# EAGLE design main (EAGLE 6.6.0)
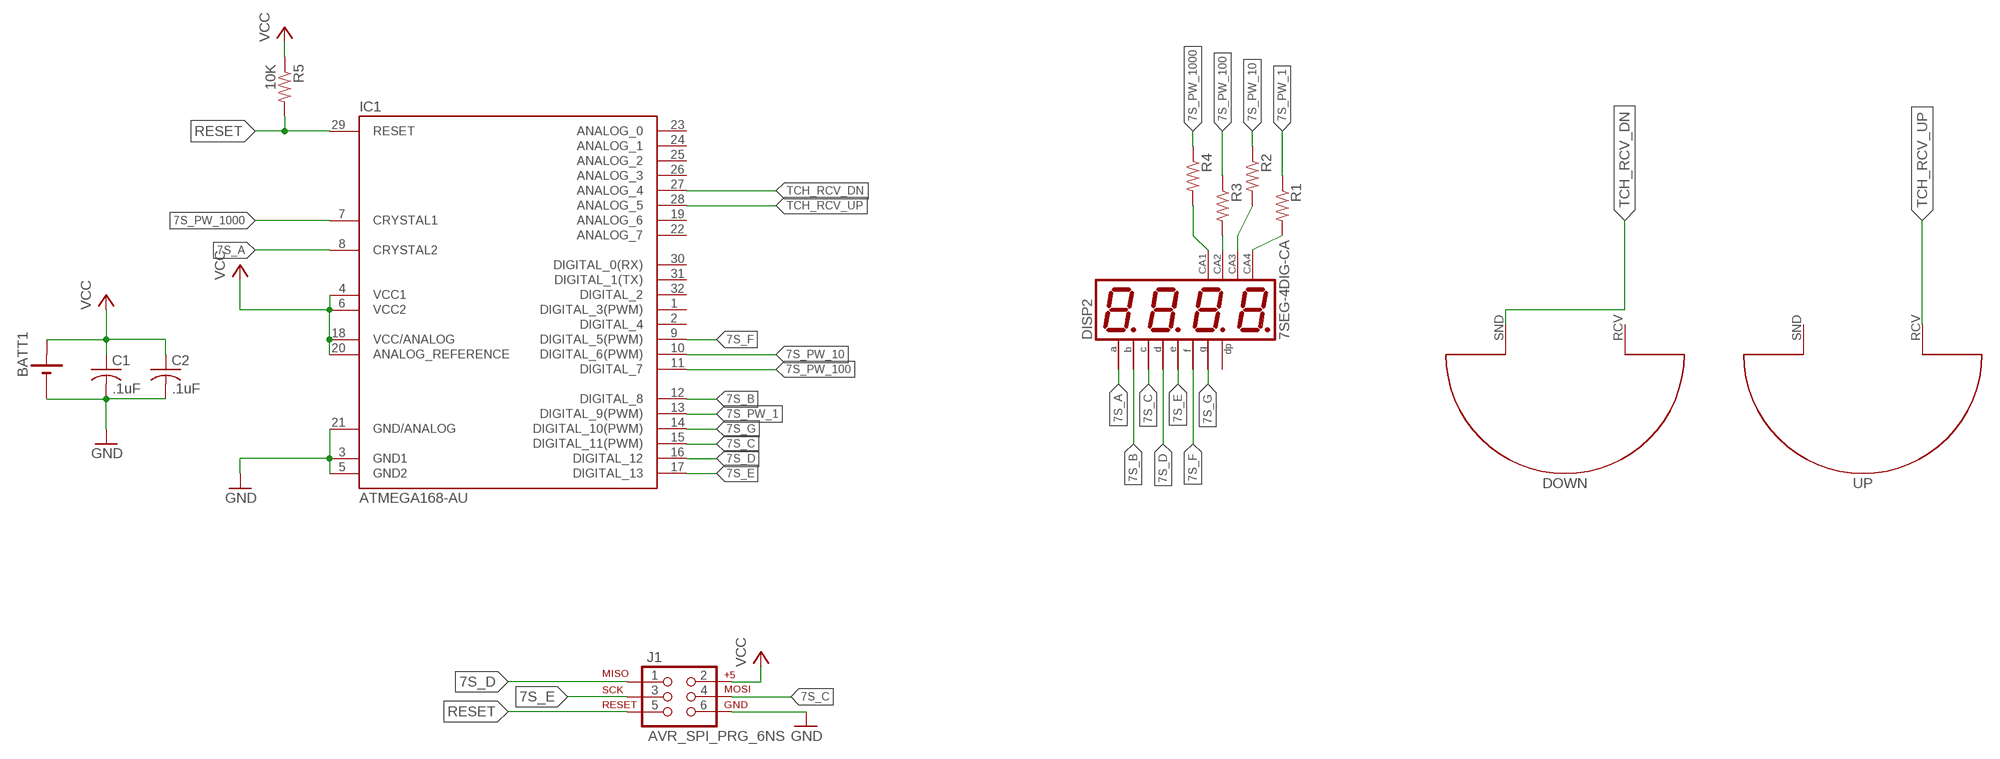
[diagram p0: schematic, sheet 1]

## Parts
BATT1  2032SMD  [2032SMD]
C1  .1uF  C-USC0603  [C0603]
C2  .1uF  C-USC0603  [C0603]
DISP2  7SEG-4DIG-CA  [7SEG-0.36-4]
DOWN  AVD-TCH-01  [AVD-TCH-01]
IC1  ATMEGA168-AU  [TQFP32-08]
J1  AVR_SPI_PRG_6NS  [2X3-NS]
R1  R-US_R0603  [R0603]
R2  R-US_R0603  [R0603]
R3  R-US_R0603  [R0603]
R4  R-US_R0603  [R0603]
R5  10K  R-US_R0603  [R0603]
UP  AVD-TCH-01  [AVD-TCH-01]

## Nets
7S_A: DISP2.11(A) IC1.8(CRYSTAL2)
7S_B: DISP2.7(B) IC1.12(DIGITAL_8)
7S_C: DISP2.4(C) IC1.15(DIGITAL_11(PWM)) J1.4
7S_D: DISP2.2(D) IC1.16(DIGITAL_12) J1.1
7S_E: DISP2.1(E) IC1.17(DIGITAL_13) J1.3
7S_F: DISP2.10(F) IC1.9(DIGITAL_5(PWM))
7S_G: DISP2.5(G) IC1.14(DIGITAL_10(PWM))
7S_PW_1: IC1.13(DIGITAL_9(PWM)) R1.1
7S_PW_10: IC1.10(DIGITAL_6(PWM)) R2.1
7S_PW_100: IC1.11(DIGITAL_7) R3.1
7S_PW_1000: IC1.7(CRYSTAL1) R4.1
GND: BATT1.- C1.2 C2.2 IC1.3(GND1) IC1.5(GND2) IC1.21(GND/ANALOG) J1.6
N$2: DISP2.6(CA4) R1.2
N$3: DISP2.8(CA3) R2.2
N$4: DISP2.9(CA2) R3.2
N$5: DISP2.12(CA1) R4.2
RESET: IC1.29(RESET) J1.5 R5.2
TCH_RCV_DN: DOWN.SND IC1.27(ANALOG_4)
TCH_RCV_UP: IC1.28(ANALOG_5) UP.RCV
VCC: BATT1.+ C1.1 C2.1 IC1.4(VCC1) IC1.6(VCC2) IC1.18(VCC/ANALOG) IC1.20(ANALOG_REFERENCE) J1.2 R5.1
Unconnected: DISP2.3(DP) DOWN.RCV IC1.1(DIGITAL_3(PWM)) IC1.2(DIGITAL_4) IC1.19(ANALOG_6) IC1.22(ANALOG_7) IC1.23(ANALOG_0) IC1.24(ANALOG_1) IC1.25(ANALOG_2) IC1.26(ANALOG_3) IC1.30(DIGITAL_0(RX)) IC1.31(DIGITAL_1(TX)) IC1.32(DIGITAL_2) UP.SND

## Library data of the parts
BATT1 = rbg-4ucon-battery:2032SMD
C1 C2 = rcl:C-US: CAPACITOR, American symbol
DISP2 = led-display-4digit:7SEG-4DIG-CA
DOWN UP = touch-me:AVD-TCH-01: AVD Touch Me Sensor, half circle, active cap.
IC1 = Arduino-AVR:ATMEGA168
J1 = SparkFun-Connectors:AVR_SPI_PRG_6: AVR ISP 6 Pin This is the reduced ISP connector for AVR programming. Common on Arduino. This footprint will take up less PCB space and can be used with a 10-pin to 6-pin adapter such as SKU: BOB-08508 **Special note about "TEST_POINT" package. The stop mask is on the top side, so if you want your programming test points to be on the bottom of your board, make sure to place this package on the bottom side of the board. This also ensure that the orientation to program from the bottom side will be correct.
R1-R5 = rcl:R-US_: RESISTOR, American symbol

## Board
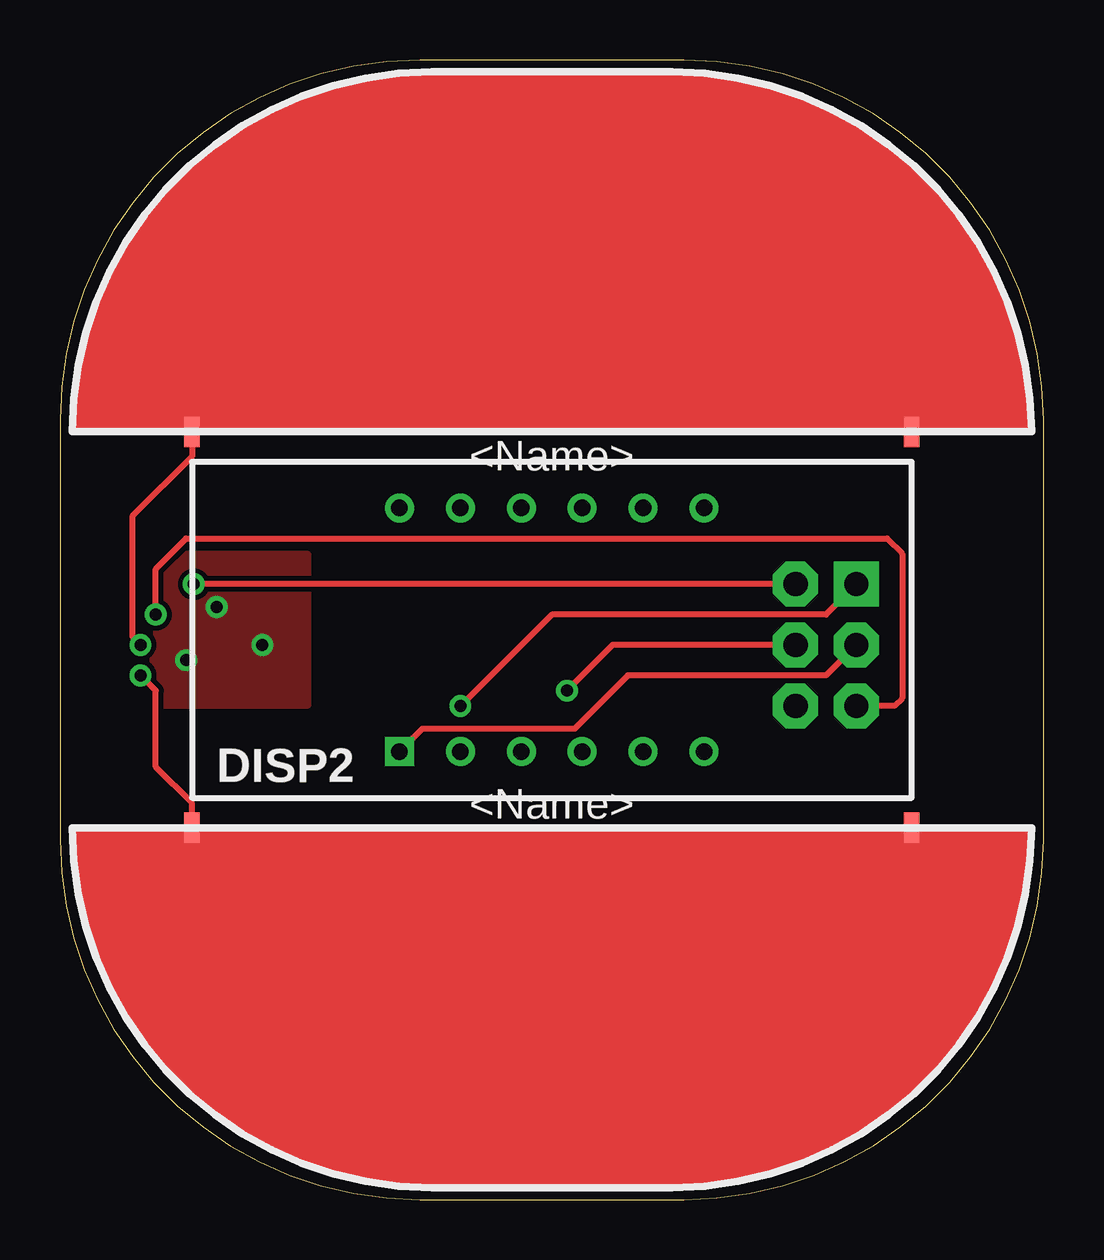
[diagram p1: board, top side]
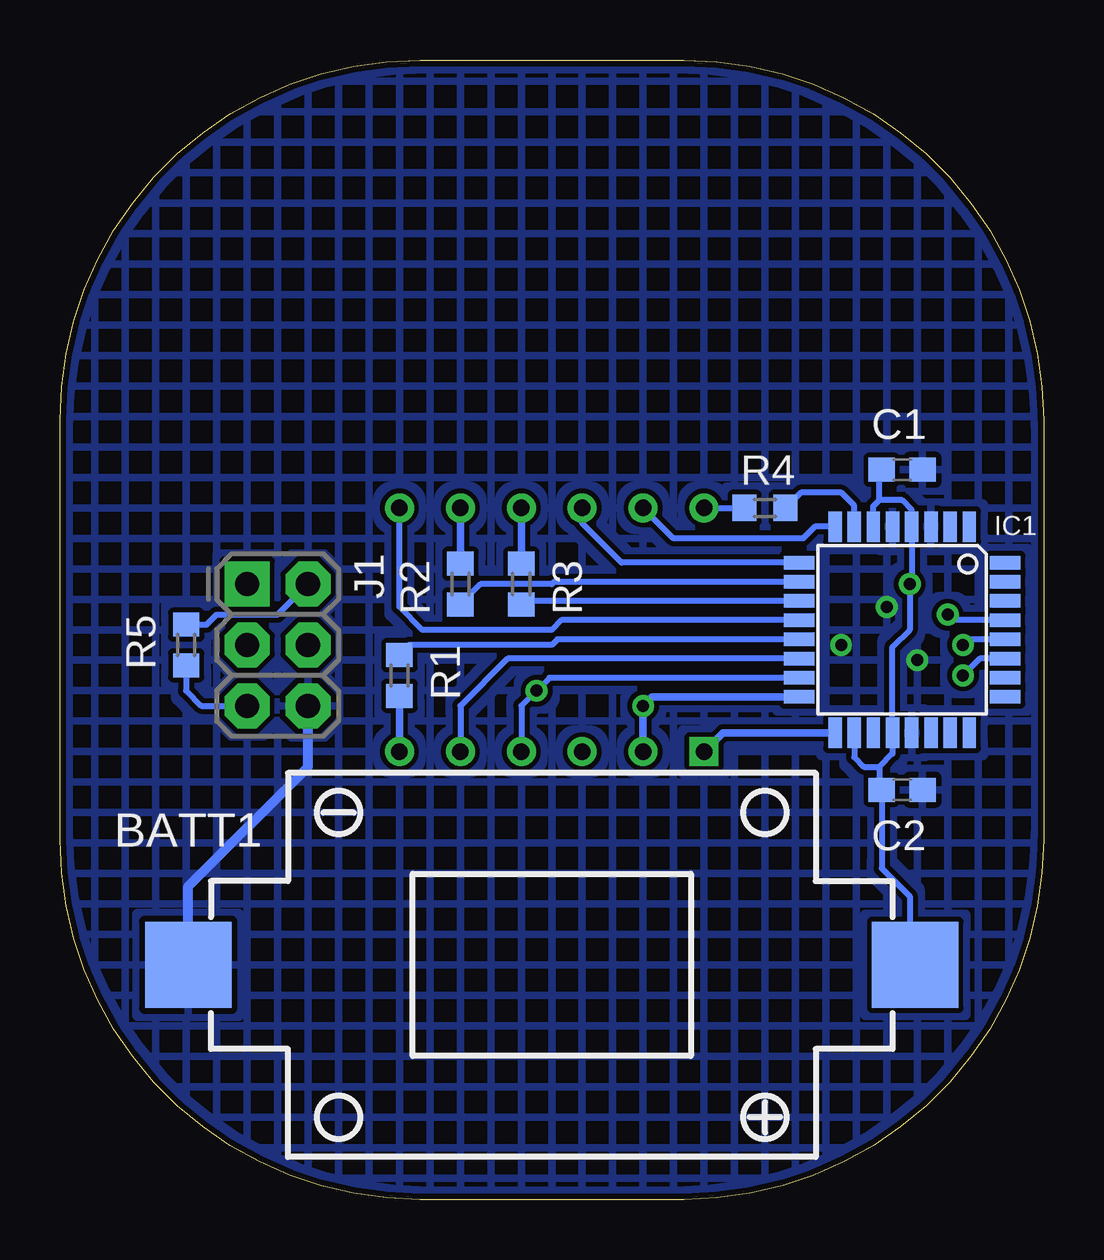
[diagram p2: board, bottom side, seen from below]

Size 41 x 47.5 mm. Coordinates in mm from the lower left corner, seen from the top.
Outline: 0,32.5 0,15 arc90 15,0 26,0 arc90 41,15 41,32.5 arc90 26,47.5 15,47.5 arc90 0,32.5
Copper layers (1*16): Top 0.035mm / dielectric 1.5mm / Bottom 0.035mm
Design rules "default *": minimum track width 8mil, minimum drill 19mil, track to track 8mil, track to pad 8mil, pad to pad 8mil, via to via 8mil, smd to smd 8mil, copper to edge 10mil, drill to drill 8mil, minimum pad ring 10mil, minimum via ring 8mil, stop-mask expansion 4mil, vias tented up to drill 20mil, thermal gap 10mil

### Footprints (pad centres in the part's own frame; a part is rotated, then mirrored left to right if it is on the bottom)
2032SMD = smd 3.6 x 3.6: + -15.15,0; - 15.15,0
C0603 = smd 1.1 x 1: 1 -0.85,0; 2 0.85,0
7SEG-0.36-4 = drill 0.7 square: 1 -6.35,-5.08 | drill 0.7: 2 -3.81,-5.08; 3 -1.27,-5.08; 4 1.27,-5.08; 5 3.81,-5.08; 6 6.35,-5.08; 7 6.35,5.08; 8 3.81,5.08; 9 1.27,5.08; 10 -1.27,5.08; 11 -3.81,5.08; 12 -6.35,5.08
AVD-TCH-01 = smd 0.635 x 1.27: RCV 15,0; SND -15,0
TQFP32-08 = smd 1.27 x 0.559: 1 -4.293,2.8; 2 -4.293,2; 3 -4.293,1.2; 4 -4.293,0.4; 5 -4.293,-0.4; 6 -4.293,-1.2; 7 -4.293,-2; 8 -4.293,-2.8; 17 4.293,-2.8; 18 4.293,-2; 19 4.293,-1.2; 20 4.293,-0.4; 21 4.293,0.4; 22 4.293,1.2; 23 4.293,2; 24 4.293,2.8 | smd 0.559 x 1.27: 9 -2.8,-4.293; 10 -2,-4.293; 11 -1.2,-4.293; 12 -0.4,-4.293; 13 0.4,-4.293; 14 1.2,-4.293; 15 2,-4.293; 16 2.8,-4.293; 25 2.8,4.293; 26 2,4.293; 27 1.2,4.293; 28 0.4,4.293; 29 -0.4,4.293; 30 -1.2,4.293; 31 -2,4.293; 32 -2.8,4.293
2X3-NS = drill 1.016 pad 1.88 square: 1 -2.54,-1.27 | drill 1.016 pad 1.88 octagon: 2 -2.54,1.27; 3 0,-1.27; 4 0,1.27; 5 2.54,-1.27; 6 2.54,1.27
R0603 = smd 1 x 1.1: 1 -0.85,0; 2 0.85,0

### Placement (x,y rotation side)
BATT1  20.5,9.78 180 bottom
C1  5.89,30.42 0 bottom
C2  5.89,17.08 0 bottom
DISP2  20.5,23.75 0 top
DOWN  20.5,15.49 0 top
IC1  5.89,23.75 270 bottom
J1  31.93,23.11 270 bottom
R1  26.85,21.84 270 bottom
R2  24.31,25.66 90 bottom
R3  21.77,25.66 90 bottom
R4  11.61,28.83 180 bottom
R5  35.74,23.11 270 bottom
UP  20.5,32.01 180 top

### Tracks (layer width: path | path; a pad name or v marks a point on that pad's centre or on a via)
7S_A
  Bottom 0.254: IC1.8 9.54,28.04 10.02,27.56 15.42,27.56 DISP2.11
7S_B
  Bottom 0.254: IC1.12 20.1,24.15 20.5,23.75 25.9,23.75 26.85,24.7 DISP2.7
7S_C  (via drill 0.5)
  Top 0.254: J1.4 23.04,23.11 v21.14,21.21
  Bottom 0.254: IC1.15 20.59,21.75 v21.14,21.21 21.77,20.57 DISP2.4
7S_D  (via drill 0.5)
  Top 0.254: J1.1 31.93,24.39 20.5,24.39 v16.69,20.57
  Bottom 0.305: IC1.16 16.32,20.95 v16.69,20.57 DISP2.2
7S_E
  Top 0.254: J1.3 31.93,21.84 23.68,21.84 21.45,19.62 15.1,19.62 DISP2.1
  Bottom 0.305: IC1.17 13.36,19.46 DISP2.1
7S_F
  Bottom 0.254: IC1.9 17.59,26.55 19.23,28.2 DISP2.10
7S_G
  Bottom 0.254: IC1.14 22.34,22.55 24.31,20.57 DISP2.5
7S_PW_1
  Bottom 0.254: IC1.13 20.27,23.35 20.5,23.11 26.43,23.11 R1.1
7S_PW_10
  Bottom 0.254: IC1.10 20.41,25.75 20.5,25.66 23.46,25.66 R2.1
7S_PW_100
  Bottom 0.254: IC1.11 21.62,24.95 R3.1
7S_PW_1000
  Bottom 0.254: IC1.7 7.89,28.93 8.44,29.46 10.12,29.46 R4.1
GND  (via drill 0.5)
  Bottom 0.406: BATT1.- 35.65,13.04 30.66,18.04 J1.6
  other vias: 5.26,22.48 6.53,24.7 8.44,23.11
  pour Bottom (hatched): -6.17,49.78 45.9,49.78 45.9,-2.29 -6.17,-2.29
  pour Top: 1.45,26.93 10.34,26.93 10.34,20.57 1.45,20.57
N$2
  Bottom 0.305: DISP2.6 R1.2
N$3
  Bottom 0.305: DISP2.8 R2.2
N$4
  Bottom 0.305: DISP2.9 R3.2
N$5
  Bottom 0.254: DISP2.12 R4.2
RESET  (via drill 0.5)
  Top 0.254: v3.99,24.39 3.99,26.29 5.26,27.56 34.47,27.56 35.11,26.93 35.11,20.89 34.79,20.57 J1.5
  Bottom 0.254: R5.2 35.74,21.21 35.11,20.57 J1.5 | IC1.29 3.75,24.15 v3.99,24.39
TCH_RCV_DN  (via drill 0.5)
  Top 0.254: DOWN.SND 5.5,16.52 3.99,18.04 3.99,21.21 v3.36,21.84
  Bottom 0.254: v3.36,21.84 2.65,22.55 IC1.27
TCH_RCV_UP  (via drill 0.5)
  Top 0.254: UP.RCV 5.5,30.98 3.04,28.51 3.04,23.43 v3.36,23.11
  Bottom 0.254: IC1.28 3.12,23.35 v3.36,23.11
VCC  (via drill 0.5)
  Top 0.254: J1.2 v5.58,25.66 5.49,25.66
  Bottom 0.254: 6.85,29.15 5.89,29.15 5.49,28.75 IC1.4 5.49,25.74 v5.58,25.66 5.58,23.75 6.29,23.03 IC1.20 6.29,18.59 6.85,18.04 | 6.85,29.15 6.85,30.41 C1.1 | IC1.6 7.1,28.9 6.85,29.15 | IC1.18 7.89,18.45 7.48,18.04 6.85,18.04 | 6.85,18.04 6.85,17.18 C2.1 6.74,13.8 5.58,12.64 5.58,10.01 BATT1.+ | R5.1 34.89,23.96 34.47,24.39 31.93,24.39 J1.2